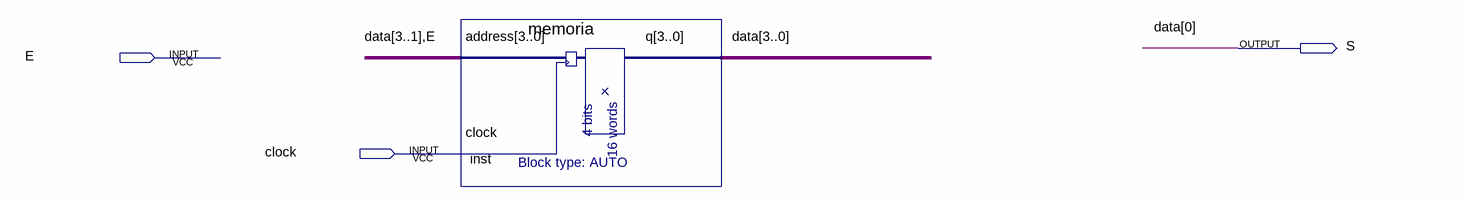
[diagram p0: schematic sheet]
// Quartus schematic dos.bdf as structural Verilog: 1 symbols, 3 pins
module dos (
  input  E,
  input  clock,
  output S
);

  wire [3:1] data;

  memoria inst (.address({data, E}), .clock(clock), .q({data, S}));

  // Other names for the same wires on the sheet: data[0] = S
endmodule
